# Altium schematic sheet Блок1.1.SchDoc
size A4; SheetNumber: 10; SheetTotal: 10
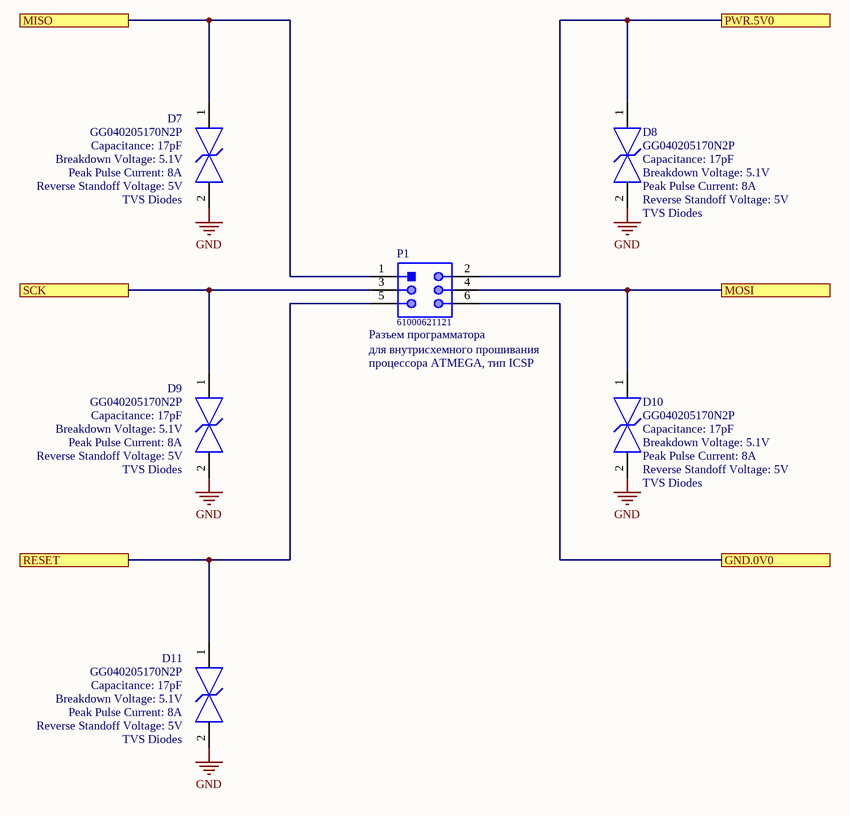
[diagram p0: Блок1.1.SchDoc]

## Parts
D7  GG040205170N2P  Capacitance: 17pF  Breakdown Voltage: 5.1V  Peak Pulse Current: 8A  Reverse Standoff Voltage: 5V  Device Class L2: TVS Diodes  [FP-GG0402-IPC_A]
D8  GG040205170N2P  Capacitance: 17pF  Breakdown Voltage: 5.1V  Peak Pulse Current: 8A  Reverse Standoff Voltage: 5V  Device Class L2: TVS Diodes  [FP-GG0402-IPC_A]
D9  GG040205170N2P  Capacitance: 17pF  Breakdown Voltage: 5.1V  Peak Pulse Current: 8A  Reverse Standoff Voltage: 5V  Device Class L2: TVS Diodes  [FP-GG0402-IPC_A]
D10  GG040205170N2P  Capacitance: 17pF  Breakdown Voltage: 5.1V  Peak Pulse Current: 8A  Reverse Standoff Voltage: 5V  Device Class L2: TVS Diodes  [FP-GG0402-IPC_A]
D11  GG040205170N2P  Capacitance: 17pF  Breakdown Voltage: 5.1V  Peak Pulse Current: 8A  Reverse Standoff Voltage: 5V  Device Class L2: TVS Diodes  [FP-GG0402-IPC_A]
P1  61000621121  Parameter 1: Разъем программатора  Parameter 2: для внутрисхемного прошивания  Parameter 3: процессора ATMEGA, тип ICSP  [61000621121]

## Ports
GND.0V0, MISO, MOSI, PWR.5V0, RESET, SCK

## Nets
GND: D7.2 D8.2 D9.2 D10.2 D11.2
GND.0V0: P1.6 ; port GND.0V0
MISO: D7.1 P1.1 ; port MISO
MOSI: D10.1 P1.4 ; port MOSI
PWR.5V0: D8.1 P1.2 ; port PWR.5V0
RESET: D11.1 P1.5 ; port RESET
SCK: D9.1 P1.3 ; port SCK

## Library data of the parts
D7-D11 = CMP-04587-000002-1: TVS DIODE 5V 10V 0402; Manufacturer: AVX; Peak Pulse Power: 80W; Value: 17pF; Number Of Channels: 1; Direction: Bidirectional; Manufacturer Part Number: GG040205170N2P; Temperature: -55°C to +125°C; Octopart: https://octopart.com/gg040205170n2p-avx-81066082; RoHS: TRUE; Clamping Voltage: 10V; Device Class L1: Circuit Protection; ComponentLink2Description: Datasheet; Category: Diode; Package: GG0402; Temperature Range High: +125°C; Digikey Description: TVS DIODE 5V 10V 0402; Ipc Land Pattern Name: DIOC10060X50; Device Class L3: unset; Automotive: No; Mouser Description: ESD Suppressor TVS Bi-Dir 5V 2-Pin Case 0402(1006Metric) T/R; ComponentLink2URL: http://datasheets.avx.com/AVX-GiGuard.pdf; Height: 0.55mm; Lead Free: Yes; Temperature Range Low: -55°C
P1 = CMP-1502-01024-1: SMT Vertical Pin Header WR-PHD, Pitch 2.54 mm, Dual Row, 6 pins; Manufacturer: Wurth Elektronik; Withstanding Voltage: 500VAC; Contact Resistance: 20mOhm; Working Voltage: 250VAC; Gender: Male; Rated Current: 3A; Pin Number: 6; Pitch: 2.54mm; Part Number: 61000621121; Operating Temperature: -40to125degC; Mounting Technology: SMT; Packaging: Tube; Datasheet URL: https://katalog.we-online.de/em/datasheet/6100xx21121.pdf; Package Reference: 61000621121; Publisher: WurthElektronik; Row Number: Dual; Orientation: Vertical; Manufacturer URL: http://www.we-online.de